# Altium schematic sheet Mainboard_MCU_Func.SchDoc
size A4
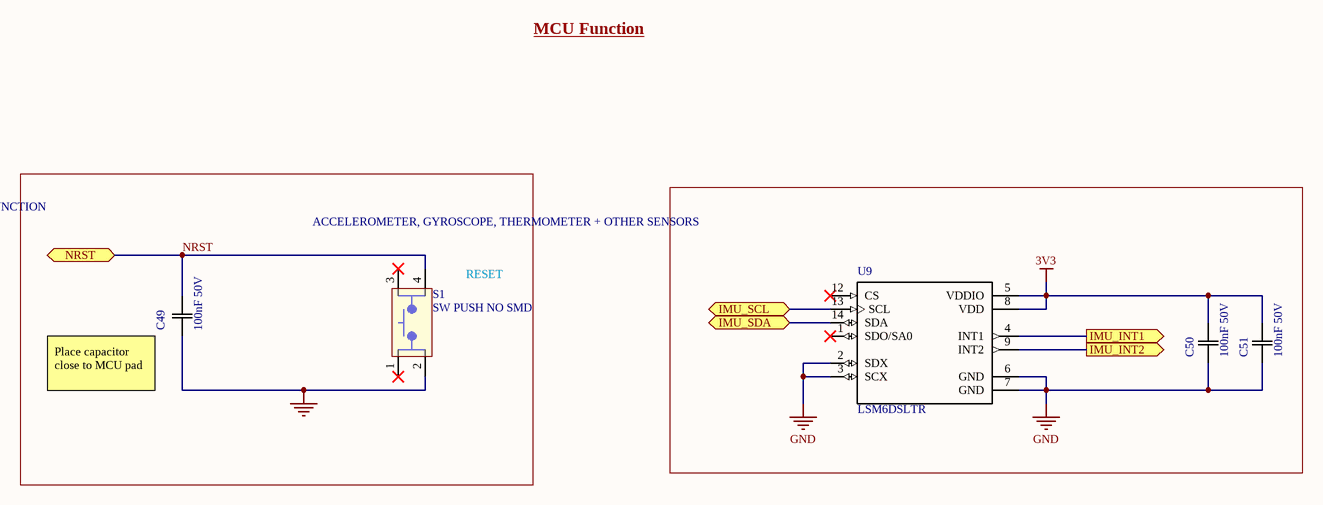
[diagram p0: Mainboard_MCU_Func.SchDoc]

## Parts
C49  100nF 50V  [0603]
C50  100nF 50V  [0603]
C51  100nF 50V  [0603]
S1  SW PUSH NO SMD  [TL3305]
U9  LSM6DSLTR  [LGA-14]

## Blocks framed on the sheet
ACCELEROMETER, GYROSCOPE, THERMOMETER + OTHER SENSORS: C50 C51 U9

## Ports
IMU_INT1 (out), IMU_INT2 (out), IMU_SCL (bidir), IMU_SDA (bidir), NRST (bidir)

## Nets
3V3: C50.2(C2) C51.2(C2) U9.5(VDDIO) U9.8(VDD)
GND: C49.1(C1) C50.1(C1) C51.1(C1) S1.2 U9.2(SDX) U9.3(SCX) U9.6(GND) U9.7(GND)
IMU_INT1: U9.4(INT1) ; port IMU_INT1
IMU_INT2: U9.9(INT2) ; port IMU_INT2
IMU_SCL: U9.13(SCL) ; port IMU_SCL
IMU_SDA: U9.14(SDA) ; port IMU_SDA
NRST: C49.2(C2) S1.4 ; port NRST

Not connected (* = marked no-connect by the designer): S1 1* 3*; U9 1(SDO/SA0)* 12(CS)*

## Notes on the sheet
- MCU Function
- RESET FUNCTION
- (near S1) RESET
- (near C49) Place capacitor close to MCU pad

## Library data of the parts
C49-C51 = CAP 100nF 50V: CAP CER 0.1UF 50V X7R 0805; Tolerance: 10%; Package: 0805; Value: 100nF; Rating: 50V
S1 = SW PUSH NO SMD: Tactile Switch SPST-NO Top Actuated Surface Mount 12V 50mA; MF: E-Switch; MP: TL3305BF260QG; Switch Function: Off-Mom; Actuator Height: 5mm; Digikey: EG5354DKR-ND; ComponentLink1Description: Digikey; ComponentLink1URL: https://www.digikey.ca/en/products/detail/e-switch/TL3305BF260QG/5816185; ComponentLink2Description: Datasheet; ComponentLink2URL: https://sten-eswitch-13110800-production.s3.amazonaws.com/system/asset/product_line/data_sheet/213/TL3305.pdf; Circuit: SPST-NO; Mounting Type: SMD
U9 = IMU LSM6DSLTR: IMU ACCEL/GYRO I2C/SPI 14LGA; MF: STMicroelectronics; SnapEDA_Link: https://www.snapeda.com/parts/LSM6DSLTR/STMicroelectronics/view-part/550517/?ref=snap; MP: LSM6DSLTR; Package: LGA-14 STMicroelectronics; Digikey: https://www.digikey.ca/product-detail/en/stmicroelectronics/LSM6DSLTR/497-16705-1-ND/6192805; Supplier 1: Digi-Key; Supplier Part Number 1: 497-16705-1-ND